# EasyEDA schematic SCH_RTC6705图传发射V0.1_2025-12-21.json

## Sheets
1 稳压和调频: TITLE: Sheet_1; REV: 1.0; Date: 2022-07-11; Sheet: 1/1; Drawn By: 意大利炮; Company: Your Company
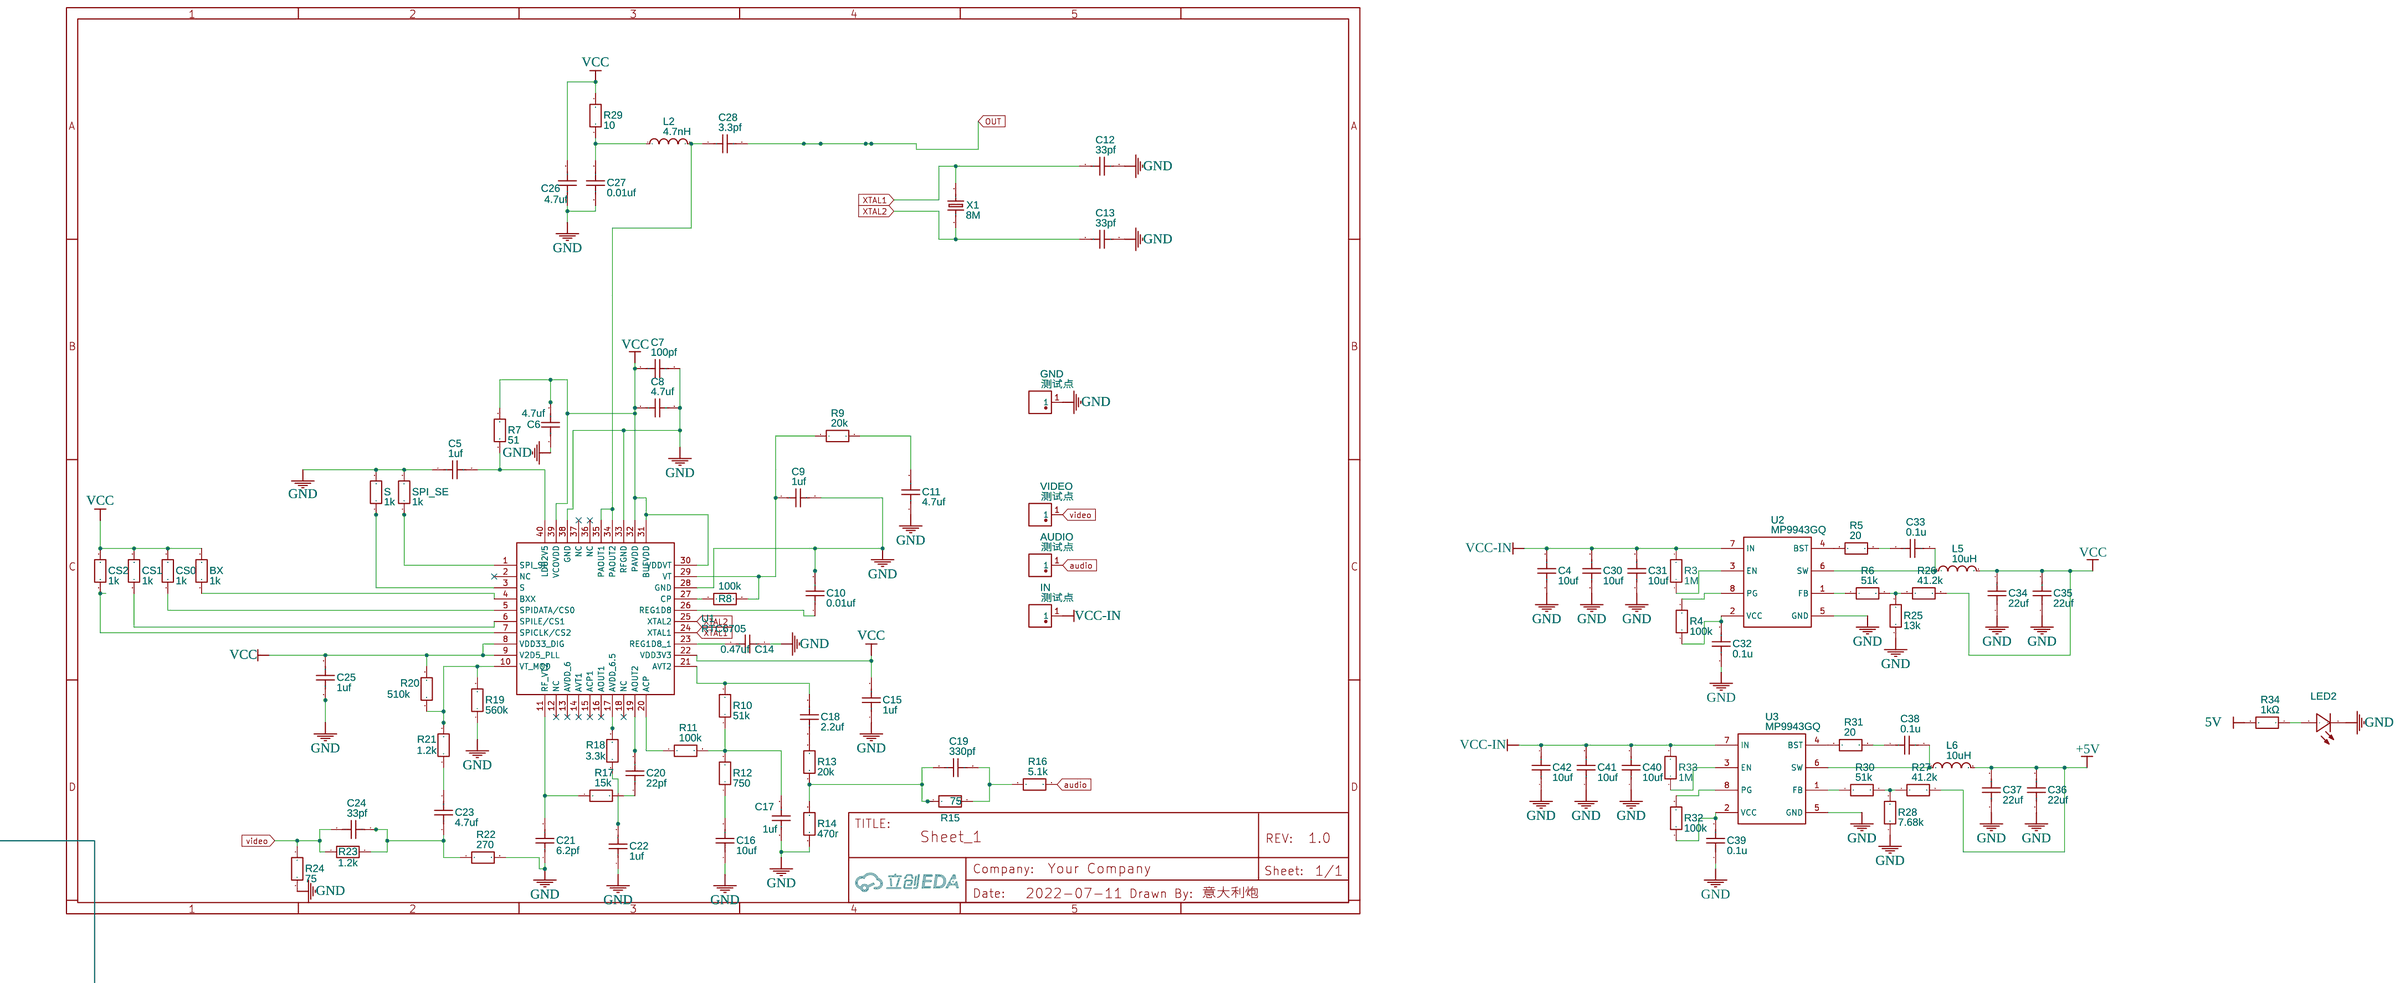
[diagram p0: 稳压和调频]
2 2W放大器: Date: 2022-07-19
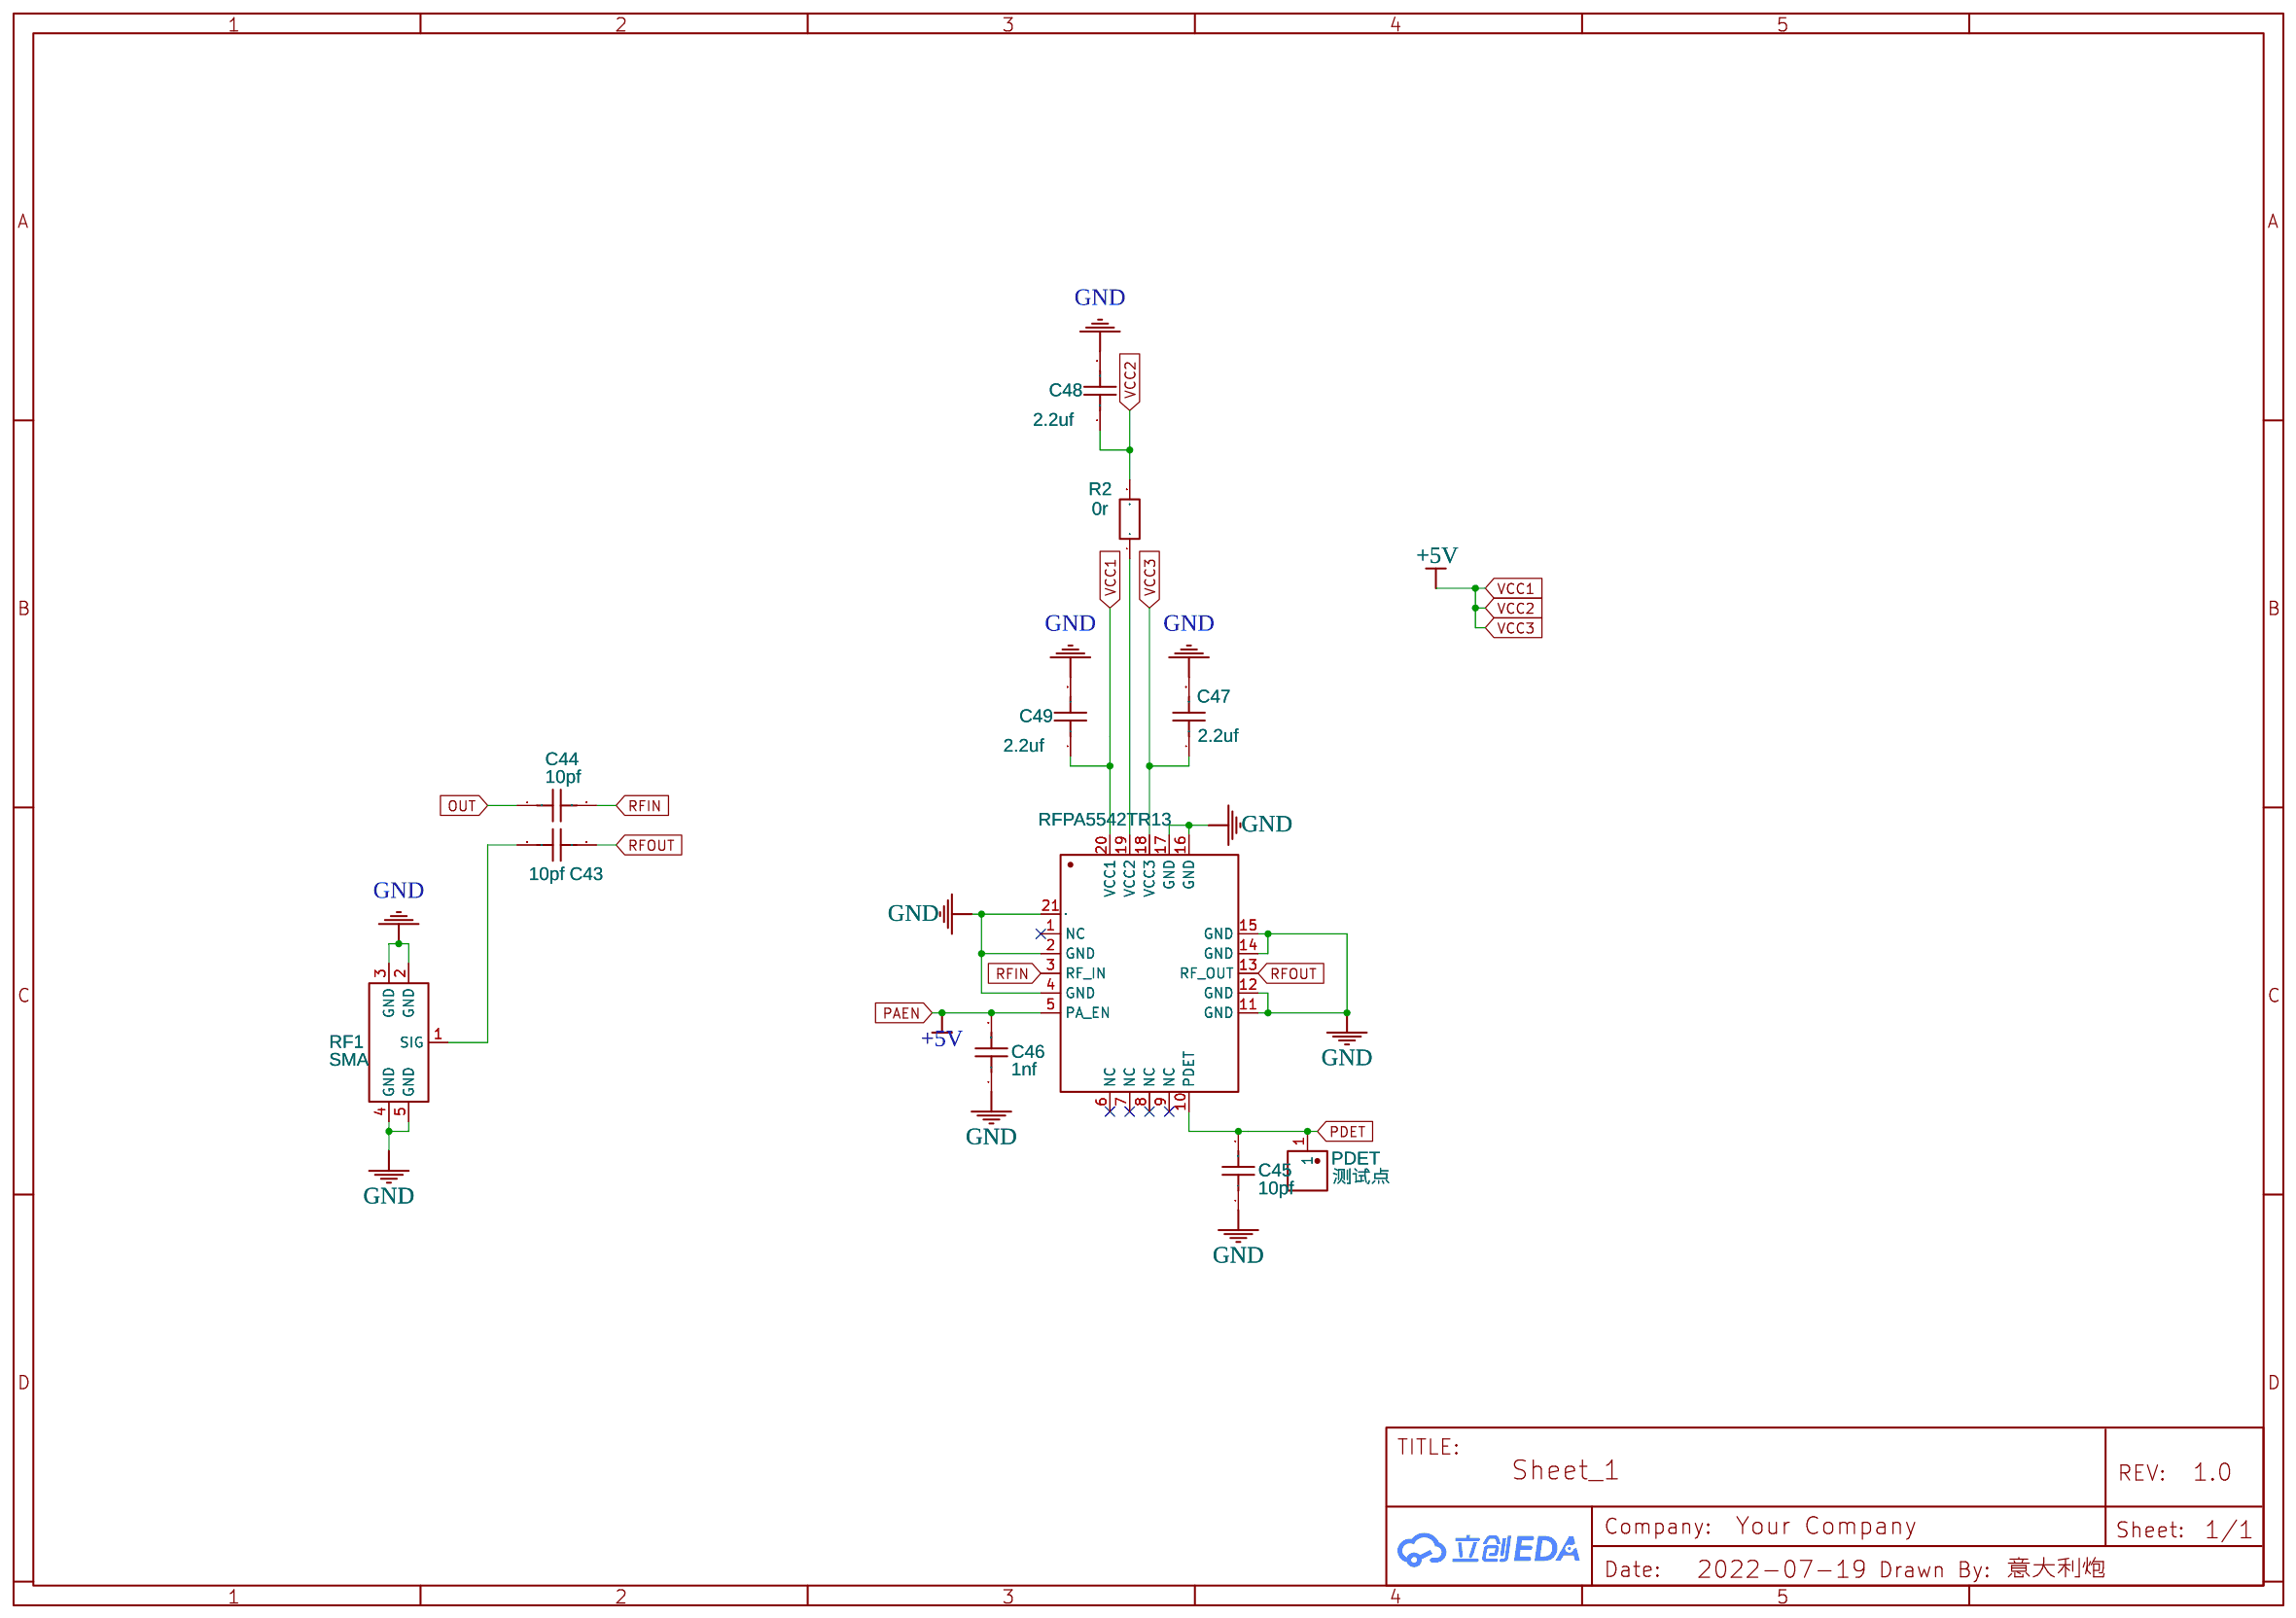
[diagram p1: 2W放大器]

## Parts
sheet 2W放大器
C43  10pf  [C0603]
C44  10pf  [C0603]
C45  10pf  [C0603]
C46  1nf  [C0603]
C47  2.2uf  [C0603]
C48  2.2uf  [C0603]
C49  2.2uf  [C0603]
PDET  测试点  [测试点]
R2  0r  [R0603]
RF1  SMA  [SMA-SMD_HJ-SMA023]
U5  RFPA5542TR13  [QFN-20_L4.0-W4.0-P0.50-BL-EP2.5]
sheet 稳压和调频
AUDIO  测试点  [测试点]
BX  1k  [R0603]
C4  10uf  [C0603]
C5  1uf  [C0603]
C6  4.7uf  [C0603]
C7  100pf  [C0603]
C8  4.7uf  [C0603]
C9  1uf  [C0603]
C10  0.01uf  [C0603]
C11  4.7uf  [C0603]
C12  33pf  [C0603]
C13  33pf  [C0603]
C14  0.47uf  [C0603]
C15  1uf  [C0603]
C16  10uf  [C0603]
C17  1uf  [C0603]
C18  2.2uf  [C0603]
C19  330pf  [C0603]
C20  22pf  [C0603]
C21  6.2pf  [C0603]
C22  1uf  [C0603]
C23  4.7uf  [C0603]
C24  33pf  [C0603]
C25  1uf  [C0603]
C26  4.7uf  [C0603]
C27  0.01uf  [C0603]
C28  3.3pf  [C0603]
C30  10uf  [C0603]
C31  10uf  [C0603]
C32  0.1u  [C0603]
C33  0.1u  [C0603]
C34  22uf  [C0805]
C35  22uf  [C0805]
C36  22uf  [C0805]
C37  22uf  [C0805]
C38  0.1u  [C0603]
C39  0.1u  [C0603]
C40  10uf  [C0603]
C41  10uf  [C0603]
C42  10uf  [C0603]
CS0  1k  [R0603]
CS1  1k  [R0603]
CS2  1k  [R0603]
GND  测试点  [测试点]
IN  测试点  [测试点]
L2  4.7nH  [L0603]
L5  10uH  [IND-SMD_L4.4-W4.0_PHC0420]
L6  10uH  [IND-SMD_L4.4-W4.0_PHC0420]
LED2  LTST-C170KRKT  [LED0805-RD]
R3  1M  [R0603]
R4  100k  [R0603]
R5  20  [R0603]
R6  51k  [R0402]
R7  51  [R0603]
R8  100k  [R0603]
R9  20k  [R0603]
R10  51k  [R0603]
R11  100k  [R0603]
R12  750  [R0603]
R13  20k  [R0603]
R14  470r  [R0603]
R15  75  [R0603]
R16  5.1k  [R0603]
R17  15k  [R0603]
R18  3.3k  [R0603]
R19  560k  [R0603]
R20  510k  [R0603]
R21  1.2k  [R0603]
R22  270  [R0603]
R23  1.2k  [R0603]
R24  75  [R0603]
R25  13k  [R0402]
R26  41.2k  [R0402]
R27  41.2k  [R0402]
R28  7.68k  [R0402]
R29  10  [R0603]
R30  51k  [R0402]
R31  20  [R0603]
R32  100k  [R0603]
R33  1M  [R0603]
R34  1kΩ  [R0805]
S  1k  [R0603]
SPI_SE  1k  [R0603]
U1  RTC6705  [QFN-40_L6.0-W6.0-P0.50-BL-EP4.1]
U2  MP9943GQ  [QFN-8_MP9943_MN]
U3  MP9943GQ  [QFN-8_MP9943_MN]
VIDEO  测试点  [测试点]
X1  8M  [HC-49S_L11.4-W4.5-LS12.3]

## Library data of the parts
C4-C28 C30-C33 C38-C49 = C_0603_US: Contributor: LCEDA_Lib
AUDIO GND IN PDET VIDEO = 测试点: Contributor: fuckfuckfuck
BX CS0-CS2 R2-R5 R7-R24 R29 R31-R33 S SPI_SE = R_0603_EU: Contributor: LCEDA_Lib
RF1 = SMA: Supplier: LCSC; Supplier Part: C1509219; Manufacturer: 皇捷; Manufacturer Part: HJ-SMA023; Contributor: LCSC; JLCPCB Part Class: Extended Part
U5 = RFPA5542TR13: Supplier: LCSC; Supplier Part: C469030; Manufacturer: Qorvo; Contributor: LCSC; JLCPCB Part Class: Extended Part
C34-C37 = C_0805_US: Contributor: LCEDA_Lib
L2 = SDCL1608C4N7STDF: Supplier: LCSC; Manufacturer: Sunlord; Supplier Part: C89955; JLCPCB Part Class: Extended Part
L5 L6 = PHC0420-100M-T: Supplier: LCSC; Supplier Part: C251694; Manufacturer: EMTEK; Contributor: LCSC; JLCPCB Part Class: Extended Part
LED2 = LTST-C170KRKT: Supplier: LCSC; Manufacturer: LITEON; Supplier Part: C94868; JLCPCB Part Class: Extended Part
R6 R25-R28 R30 = R_0402_EU: Contributor: LCEDA_Lib
R34 = ESR10EZPF1001: Supplier: LCSC; Supplier Part: C510097; Manufacturer: ROHM Semicon; Contributor: LCSC; JLCPCB Part Class: Extended Part
U1 = RTC6705: Manufacturer: Richwave; link: https://www.richwave.com.tw/en/page_prd_new.aspx?Id=8; Contributor: hljjmsr
U2 U3 = MP9943GQ: Manufacturer: MPS; Contributor: msnrooon
X1 = 8M晶振_C9900021502: Supplier: LCSC; Supplier Part: C9900021502; Manufacturer: null; Manufacturer Part: 8M晶振; JLCPCB Part Class: Extended Part; Contributor: lcsc

## Nets
5V: R34.2
+5V: C36.2 C37.2 C46.2 C47.1 C48.1 C49.1 L6.2 R2.2 R27.2 U5.5(PA_EN) U5.18(VCC3) U5.20(VCC1)
GND: C4.1 C5.1 C6.1 C7.2 C8.2 C9.2 C10.2 C11.1 C12.2 C13.2 C14.2 C15.1 C16.1 C17.1 C21.1 C22.1 C25.1 C26.1 C27.1 C30.1 C31.1 C32.1 C34.1 C35.1 C36.1 C37.1 C39.1 C40.1 C41.1 C42.1 C45.1 C46.1 C47.2 C48.2 C49.2 GND.1 LED2.1(-) R14.1 R19.1 R22.2 R24.1 R25.1 R28.1 RF1.2(GND) RF1.3(GND) RF1.4(GND) RF1.5(GND) S.2 SPI_SE.2 U1.28(GND) U1.33(RFGND) U1.38(GND) U2.5(GND) U3.5(GND) U5.2(GND) U5.4(GND) U5.11(GND) U5.12(GND) U5.14(GND) U5.15(GND) U5.16(GND) U5.17(GND) U5.21(PAD)
VCC: BX.2 C6.2 C7.1 C8.1 C15.2 C25.2 C26.2 C34.2 C35.2 CS0.2 CS1.2 CS2.2 L5.2 R7.2 R20.2 R26.2 R29.2 U1.8(VDD33_DIG) U1.9(V2D5_PLL) U1.22(VDD3V3) U1.30(VDDVT) U1.31(BUFVDD) U1.32(PAVDD) U1.39(VCOVDD)
VCC-IN: C4.2 C30.2 C31.2 C40.2 C41.2 C42.2 IN.1 R3.2 R33.2 U2.7(IN) U3.7(IN)
audio: AUDIO.1 R16.2
OUT: C28.2 C44.1
PDET: C45.2 PDET.1 U5.10(PDET)
RFIN: C44.2 U5.3(RF_IN)
RFOUT: C43.2 U5.13(RF_OUT)
video: C24.1 R23.1 R24.2 VIDEO.1
XTAL1: C12.1 U1.24(XTAL1) X1.2
XTAL2: C13.1 U1.25(XTAL2) X1.1
Net-(BX-1): BX.1 U1.4(BXX)
Net-(C5-2): C5.2 R7.1 U1.40(LDO2V5)
Net-(C9-1): C9.1 R8.2 R9.1 U1.29(VT)
Net-(C10-1): C10.1 U1.26(REG1D8)
Net-(C11-2): C11.2 R9.2
Net-(C14-1): C14.1 U1.23(REG1D8_1)
Net-(C16-2): C16.2 R12.1
Net-(C17-2): C17.2 R10.1 R11.2 R12.2
Net-(C18-1): C18.1 R13.2
Net-(C18-2): C18.2 R10.2 U1.21(AVT2)
Net-(C19-1): C19.1 R13.1 R14.2 R15.1
Net-(C19-2): C19.2 R15.2 R16.1
Net-(C20-1): C20.1 R17.2
Net-(C20-2): C20.2 U1.19(AOUT2)
Net-(C21-2): C21.2 R17.1 U1.11(RF_VT2)
Net-(C22-2): C22.2 R18.1
Net-(C23-1): C23.1 C24.2 R22.1 R23.2
Net-(C23-2): C23.2 R21.1
Net-(C27-2): C27.2 L2.1 R29.1
Net-(C28-1): C28.1 L2.2 U1.34(PAOUT2) U1.35(PAOUT1)
Net-(C32-2): C32.2 R4.1 U2.2(VCC)
Net-(C33-1): C33.1 R5.2
Net-(C33-2): C33.2 L5.1 U2.6(SW)
Net-(C38-1): C38.1 R31.2
Net-(C38-2): C38.2 L6.1 U3.6(SW)
Net-(C39-2): C39.2 R32.1 U3.2(VCC)
Net-(C43-1): C43.1 RF1.1(SIG)
Net-(CS0-1): CS0.1 U1.5(SPIDATA/CS0)
Net-(CS1-1): CS1.1 U1.6(SPILE/CS1)
Net-(CS2-1): CS2.1 U1.7(SPICLK/CS2)
Net-(LED2-2): LED2.2(+) R34.1
Net-(R2-1): R2.1 U5.19(VCC2)
Net-(R3-1): R3.1 U2.3(EN)
Net-(R4-2): R4.2 U2.8(PG)
Net-(R5-1): R5.1 U2.4(BST)
Net-(R6-1): R6.1 U2.1(FB)
Net-(R6-2): R6.2 R25.2 R26.1
Net-(R8-1): R8.1 U1.27(CP)
Net-(R11-1): R11.1 U1.20(ACP)
Net-(R18-2): R18.2 U1.17(AVDD_6.5)
Net-(R19-2): R19.2 R20.1 R21.2 U1.10(VT_MOD)
Net-(R27-1): R27.1 R28.2 R30.2
Net-(R30-1): R30.1 U3.1(FB)
Net-(R31-1): R31.1 U3.4(BST)
Net-(R32-2): R32.2 U3.8(PG)
Net-(R33-1): R33.1 U3.3(EN)
Net-(S-1): S.1 U1.3(S)
Net-(SPI_SE-1): SPI_SE.1 U1.1(SPI_SE)

Not connected (* = marked no-connect by the designer): U1 2(NC)* 12(NC)* 13(AVDD_6)* 14(AVT1)* 15(ACP1)* 16(AOUT1)* 18(NC)* 36(NC)* 37(NC)*; U5 1(NC)* 6(NC)* 7(NC)* 8(NC)* 9(NC)*
